# EAGLE schematic fpga (EAGLE 6.6.0)
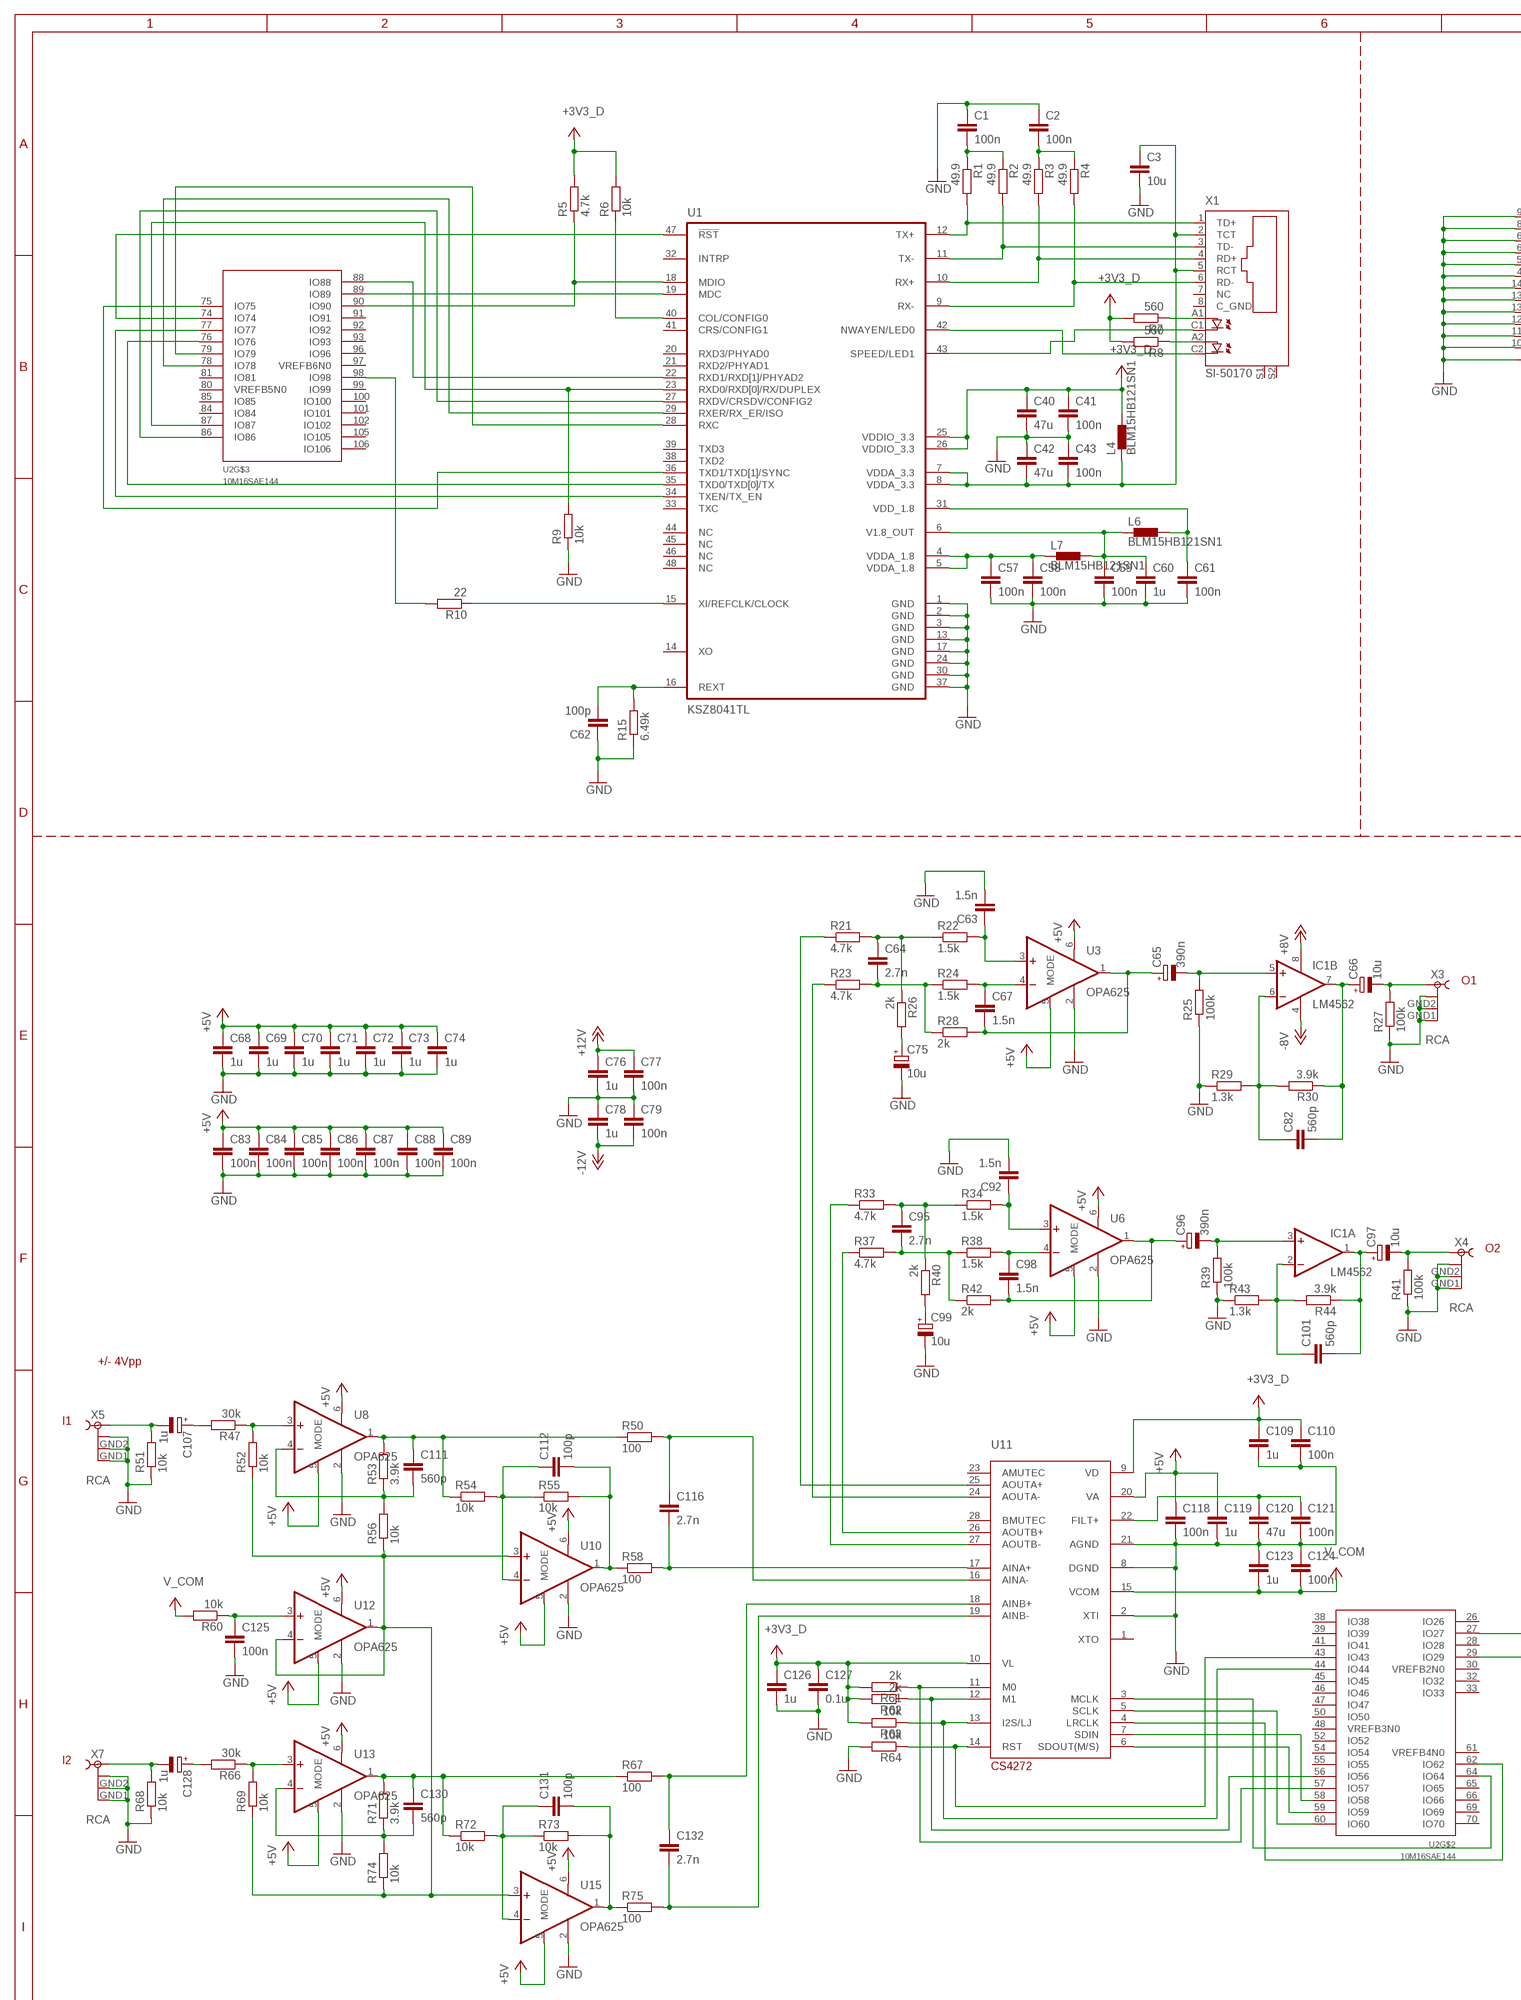
[diagram p0: schematic, sheet 1, part 1 of 2]
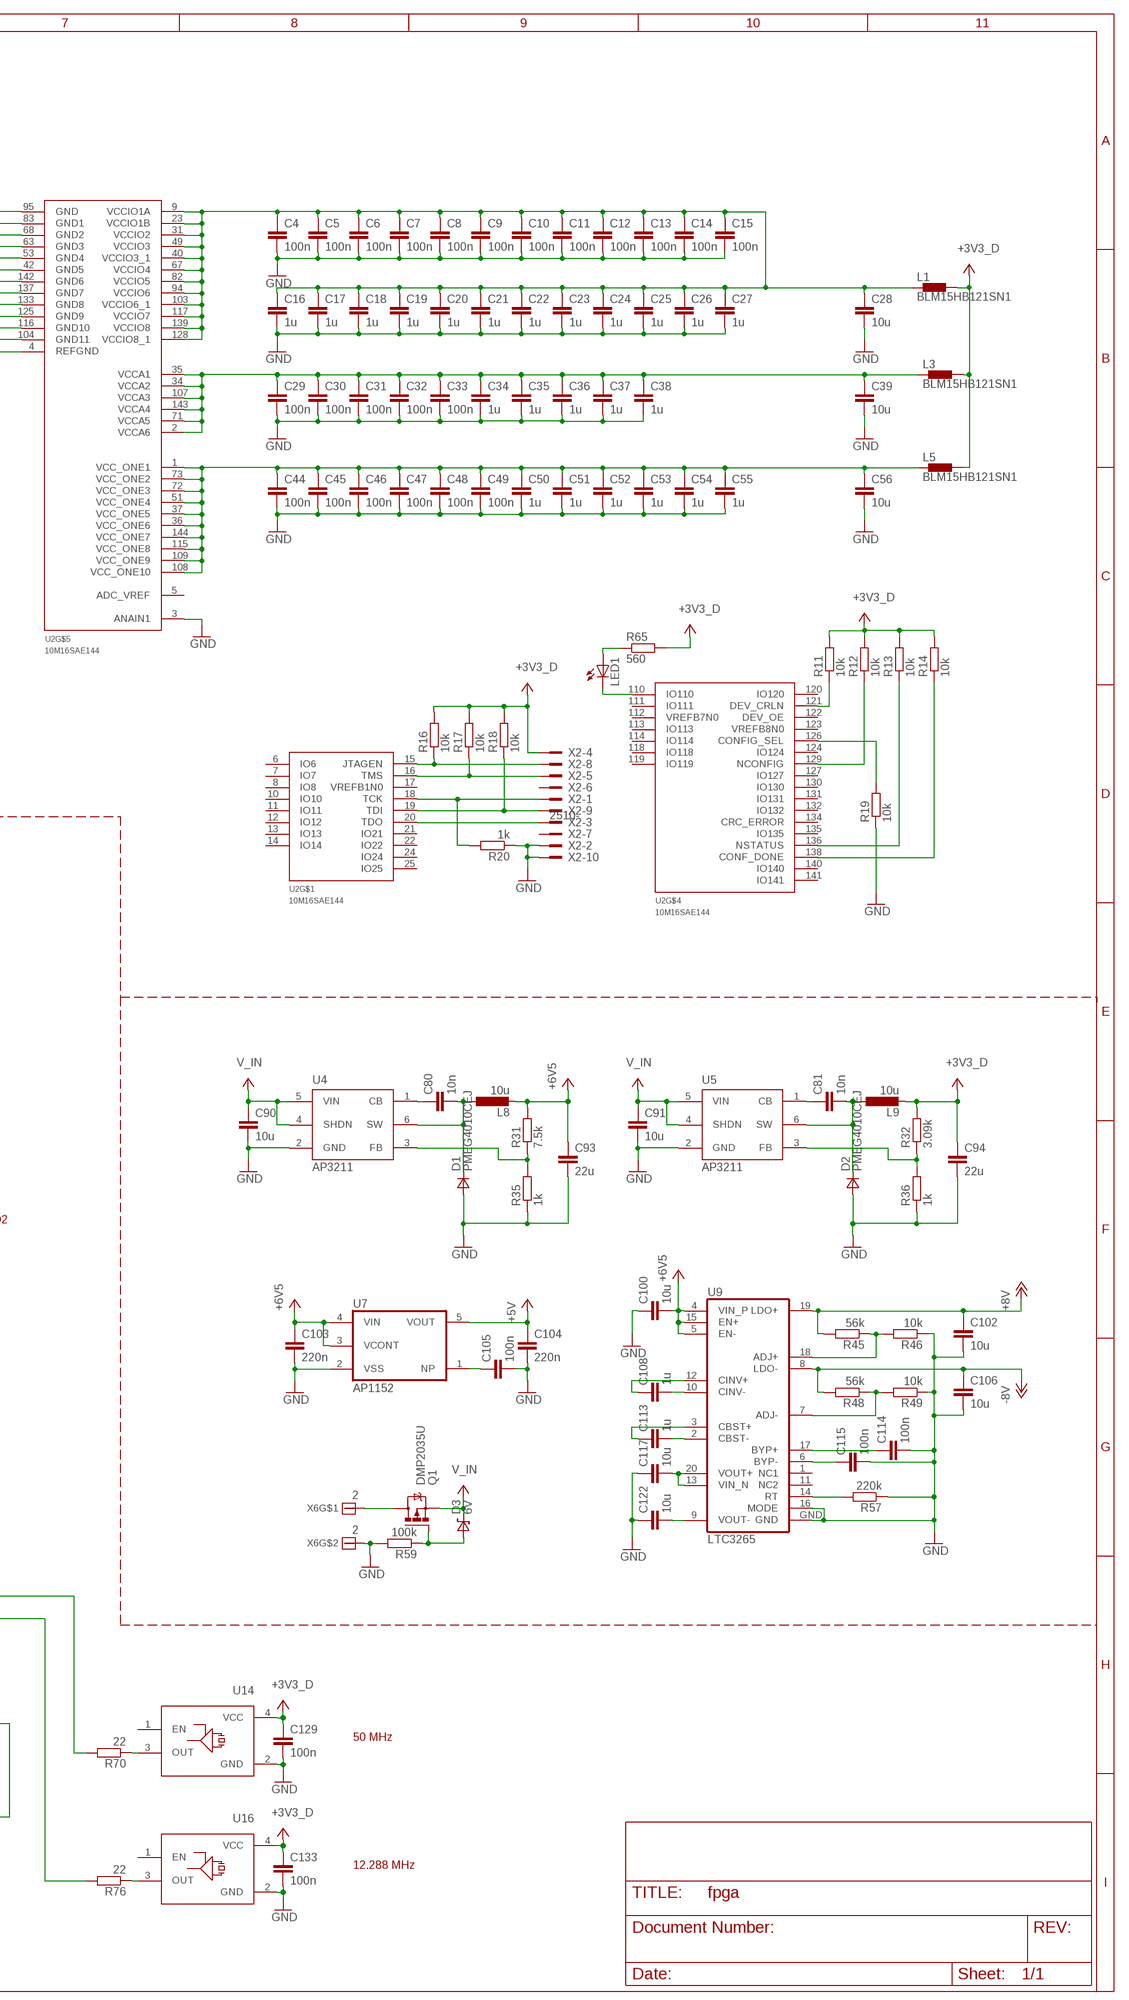
[diagram p1: schematic, sheet 1, part 2 of 2]

## Parts
C1  100n  C-EUC0603K  [C0603K]
C2  100n  C-EUC0603K  [C0603K]
C3  10u  C-EUC0805  [C0805]
C4  100n  C-EUC0603K  [C0603K]
C5  100n  C-EUC0603K  [C0603K]
C6  100n  C-EUC0603K  [C0603K]
C7  100n  C-EUC0603K  [C0603K]
C8  100n  C-EUC0603K  [C0603K]
C9  100n  C-EUC0603K  [C0603K]
C10  100n  C-EUC0603K  [C0603K]
C11  100n  C-EUC0603K  [C0603K]
C12  100n  C-EUC0603K  [C0603K]
C13  100n  C-EUC0603K  [C0603K]
C14  100n  C-EUC0603K  [C0603K]
C15  100n  C-EUC0603K  [C0603K]
C16  1u  C-EUC0603K  [C0603K]
C17  1u  C-EUC0603K  [C0603K]
C18  1u  C-EUC0603K  [C0603K]
C19  1u  C-EUC0603K  [C0603K]
C20  1u  C-EUC0603K  [C0603K]
C21  1u  C-EUC0603K  [C0603K]
C22  1u  C-EUC0603K  [C0603K]
C23  1u  C-EUC0603K  [C0603K]
C24  1u  C-EUC0603K  [C0603K]
C25  1u  C-EUC0603K  [C0603K]
C26  1u  C-EUC0603K  [C0603K]
C27  1u  C-EUC0603K  [C0603K]
C28  10u  C-EUC0603K  [C0603K]
C29  100n  C-EUC0603K  [C0603K]
C30  100n  C-EUC0603K  [C0603K]
C31  100n  C-EUC0603K  [C0603K]
C32  100n  C-EUC0603K  [C0603K]
C33  100n  C-EUC0603K  [C0603K]
C34  1u  C-EUC0603K  [C0603K]
C35  1u  C-EUC0603K  [C0603K]
C36  1u  C-EUC0603K  [C0603K]
C37  1u  C-EUC0603K  [C0603K]
C38  1u  C-EUC0603K  [C0603K]
C39  10u  C-EUC0603K  [C0603K]
C40  47u  C-EUC0805  [C0805]
C41  100n  C-EUC0603K  [C0603K]
C42  47u  C-EUC0805  [C0805]
C43  100n  C-EUC0603K  [C0603K]
C44  100n  C-EUC0603K  [C0603K]
C45  100n  C-EUC0603K  [C0603K]
C46  100n  C-EUC0603K  [C0603K]
C47  100n  C-EUC0603K  [C0603K]
C48  100n  C-EUC0603K  [C0603K]
C49  100n  C-EUC0603K  [C0603K]
C50  1u  C-EUC0603K  [C0603K]
C51  1u  C-EUC0603K  [C0603K]
C52  1u  C-EUC0603K  [C0603K]
C53  1u  C-EUC0603K  [C0603K]
C54  1u  C-EUC0603K  [C0603K]
C55  1u  C-EUC0603K  [C0603K]
C56  10u  C-EUC0603K  [C0603K]
C57  100n  C-EUC0603K  [C0603K]
C58  100n  C-EUC0603K  [C0603K]
C59  100n  C-EUC0603K  [C0603K]
C60  1u  C-EUC0603K  [C0603K]
C61  100n  C-EUC0603K  [C0603K]
C62  100p  C-EUC0603K  [C0603K]
C63  1.5n  C-EUC0603K  [C0603K]
C64  2.7n  C-EUC0603K  [C0603K]
C65  390n  CPOL-EU153CLV-0405  [153CLV-0405]
C66  10u  CPOL-EU153CLV-0405  [153CLV-0405]
C67  1.5n  C-EUC0603K  [C0603K]
C68  1u  C-EUC0603K  [C0603K]
C69  1u  C-EUC0603K  [C0603K]
C70  1u  C-EUC0603K  [C0603K]
C71  1u  C-EUC0603K  [C0603K]
C72  1u  C-EUC0603K  [C0603K]
C73  1u  C-EUC0603K  [C0603K]
C74  1u  C-EUC0603K  [C0603K]
C75  10u  CPOL-EU153CLV-0405  [153CLV-0405]
C76  1u  C-EUC0603K  [C0603K]
C77  100n  C-EUC0603K  [C0603K]
C78  1u  C-EUC0603K  [C0603K]
C79  100n  C-EUC0603K  [C0603K]
C80  10n  C-EUC0603K  [C0603K]
C81  10n  C-EUC0603K  [C0603K]
C82  560p  C-EUC0603K  [C0603K]
C83  100n  C-EUC0603K  [C0603K]
C84  100n  C-EUC0603K  [C0603K]
C85  100n  C-EUC0603K  [C0603K]
C86  100n  C-EUC0603K  [C0603K]
C87  100n  C-EUC0603K  [C0603K]
C88  100n  C-EUC0603K  [C0603K]
C89  100n  C-EUC0603K  [C0603K]
C90  10u  C-EUC0805  [C0805]
C91  10u  C-EUC0805  [C0805]
C92  1.5n  C-EUC0603K  [C0603K]
C93  22u  C-EUC1206  [C1206]
C94  22u  C-EUC1206  [C1206]
C95  2.7n  C-EUC0603K  [C0603K]
C96  390n  CPOL-EU153CLV-0405  [153CLV-0405]
C97  10u  CPOL-EU153CLV-0405  [153CLV-0405]
C98  1.5n  C-EUC0603K  [C0603K]
C99  10u  CPOL-EU153CLV-0405  [153CLV-0405]
C100  10u  C-EUC0603K  [C0603K]
C101  560p  C-EUC0603K  [C0603K]
C102  10u  C-EUC0603K  [C0603K]
C103  220n  C-EUC0603K  [C0603K]
C104  220n  C-EUC0603K  [C0603K]
C105  100n  C-EUC0603K  [C0603K]
C106  10u  C-EUC0603K  [C0603K]
C107  1u  CPOL-EU153CLV-0405  [153CLV-0405]
C108  1u  C-EUC0603K  [C0603K]
C109  1u  C-EUC0603K  [C0603K]
C110  100n  C-EUC0603K  [C0603K]
C111  560p  C-EUC0603K  [C0603K]
C112  100p  C-EUC0603K  [C0603K]
C113  1u  C-EUC0603K  [C0603K]
C114  100n  C-EUC0603K  [C0603K]
C115  100n  C-EUC0603K  [C0603K]
C116  2.7n  C-EUC0603K  [C0603K]
C117  10u  C-EUC0603K  [C0603K]
C118  100n  C-EUC0603K  [C0603K]
C119  1u  C-EUC0603K  [C0603K]
C120  47u  C-EUC0805  [C0805]
C121  100n  C-EUC0603K  [C0603K]
C122  10u  C-EUC0603K  [C0603K]
C123  1u  C-EUC0603K  [C0603K]
C124  100n  C-EUC0603K  [C0603K]
C125  100n  C-EUC0603K  [C0603K]
C126  1u  C-EUC0603K  [C0603K]
C127  0.1u  C-EUC0603K  [C0603K]
C128  1u  CPOL-EU153CLV-0405  [153CLV-0405]
C129  100n  C-EUC0603K  [C0603K]
C130  560p  C-EUC0603K  [C0603K]
C131  100p  C-EUC0603K  [C0603K]
C132  2.7n  C-EUC0603K  [C0603K]
C133  100n  C-EUC0603K  [C0603K]
D1  PMEG4010CEJ  DSOD323  [SOD323]
D2  PMEG4010CEJ  DSOD323  [SOD323]
D3  6V  DSOD323  [SOD323]
IC1  LM4562  LM4558D  [SO08]
L1  BLM15HB121SN1  [0402]
L3  BLM15HB121SN1  [0402]
L4  BLM15HB121SN1  [0402]
L5  BLM15HB121SN1  [0402]
L6  BLM15HB121SN1  [0402]
L7  BLM15HB121SN1  [0402]
L8  10u  L-EU  [AAA]
L9  10u  L-EU  [AAA]
LED1  LEDCHIPLED_0603  [CHIPLED_0603]
Q1  DMP2035U  IRLML5203  [MICRO3]
R1  49.9  R-EU_R0603  [R0603]
R2  49.9  R-EU_R0603  [R0603]
R3  49.9  R-EU_R0603  [R0603]
R4  49.9  R-EU_R0603  [R0603]
R5  4.7k  R-EU_R0603  [R0603]
R6  10k  R-EU_R0603  [R0603]
R7  560  R-EU_R0603  [R0603]
R8  560  R-EU_R0603  [R0603]
R9  10k  R-EU_R0603  [R0603]
R10  22  R-EU_R0603  [R0603]
R11  10k  R-EU_R0603  [R0603]
R12  10k  R-EU_R0603  [R0603]
R13  10k  R-EU_R0603  [R0603]
R14  10k  R-EU_R0603  [R0603]
R15  6.49k  R-EU_R0603  [R0603]
R16  10k  R-EU_R0603  [R0603]
R17  10k  R-EU_R0603  [R0603]
R18  10k  R-EU_R0603  [R0603]
R19  10k  R-EU_R0603  [R0603]
R20  1k  R-EU_R0603  [R0603]
R21  4.7k  R-EU_R0603  [R0603]
R22  1.5k  R-EU_R0603  [R0603]
R23  4.7k  R-EU_R0603  [R0603]
R24  1.5k  R-EU_R0603  [R0603]
R25  100k  R-EU_R0603  [R0603]
R26  2k  R-EU_R0603  [R0603]
R27  100k  R-EU_R0603  [R0603]
R28  2k  R-EU_R0603  [R0603]
R29  1.3k  R-EU_R0603  [R0603]
R30  3.9k  R-EU_R0603  [R0603]
R31  7.5k  R-EU_R0603  [R0603]
R32  3.09k  R-EU_R0603  [R0603]
R33  4.7k  R-EU_R0603  [R0603]
R34  1.5k  R-EU_R0603  [R0603]
R35  1k  R-EU_R0603  [R0603]
R36  1k  R-EU_R0603  [R0603]
R37  4.7k  R-EU_R0603  [R0603]
R38  1.5k  R-EU_R0603  [R0603]
R39  100k  R-EU_R0603  [R0603]
R40  2k  R-EU_R0603  [R0603]
R41  100k  R-EU_R0603  [R0603]
R42  2k  R-EU_R0603  [R0603]
R43  1.3k  R-EU_R0603  [R0603]
R44  3.9k  R-EU_R0603  [R0603]
R45  56k  R-EU_R0603  [R0603]
R46  10k  R-EU_R0603  [R0603]
R47  30k  R-EU_R0603  [R0603]
R48  56k  R-EU_R0603  [R0603]
R49  10k  R-EU_R0603  [R0603]
R50  100  R-EU_R0603  [R0603]
R51  10k  R-EU_R0603  [R0603]
R52  10k  R-EU_R0603  [R0603]
R53  3.9k  R-EU_R0603  [R0603]
R54  10k  R-EU_R0603  [R0603]
R55  10k  R-EU_R0603  [R0603]
R56  10k  R-EU_R0603  [R0603]
R57  220k  R-EU_R0603  [R0603]
R58  100  R-EU_R0603  [R0603]
R59  100k  R-EU_R0603  [R0603]
R60  10k  R-EU_R0603  [R0603]
R61  2k  R-EU_R0603  [R0603]
R62  2k  R-EU_R0603  [R0603]
R63  10k  R-EU_R0603  [R0603]
R64  10k  R-EU_R0603  [R0603]
R65  560  R-EU_R0603  [R0603]
R66  30k  R-EU_R0603  [R0603]
R67  100  R-EU_R0603  [R0603]
R68  10k  R-EU_R0603  [R0603]
R69  10k  R-EU_R0603  [R0603]
R70  22  R-EU_R0603  [R0603]
R71  3.9k  R-EU_R0603  [R0603]
R72  10k  R-EU_R0603  [R0603]
R73  10k  R-EU_R0603  [R0603]
R74  10k  R-EU_R0603  [R0603]
R75  100  R-EU_R0603  [R0603]
R76  22  R-EU_R0603  [R0603]
U1  KSZ8041TL  [TQFP48]
U2  10M16SAE144  [EQFP144]
U3  OPA625  [SOT23-6]
U4  AP3211  LMR14205  [TSOT23-6_DDC]
U5  AP3211  LMR14205  [TSOT23-6_DDC]
U6  OPA625  [SOT23-6]
U7  AP1152  [SOT89-5]
U8  OPA625  [SOT23-6]
U9  LTC3265  [TSSOP20_GND]
U10  OPA625  [SOT23-6]
U11  CS4272  [TSSOP28]
U12  OPA625  [SOT23-6]
U13  OPA625  [SOT23-6]
U14  49.152MHz  LFSPXO009686  [OSC]
U15  OPA625  [SOT23-6]
U16  50MHz  LFSPXO009686  [OSC]
X1  SI-50170  [SI-50170]
X2  2510-  [PAK100/2500-10]
X3  RCA  [RCA]
X4  RCA  [RCA]
X5  RCA  [RCA]
X6  2  [2]
X7  RCA  [RCA]

## Nets
+3V3_D: C40.1 C41.1 C94.1 C109.1 C110.1 C126.1 C127.1 C129.1 C133.1 L1.2 L3.2 L4.2 L5.2 L9.P$2 R5.2 R6.2 R7.2 R8.2 R11.2 R12.2 R13.2 R14.2 R16.2 R17.2 R18.2 R32.2 R61.2 R62.2 R63.2 R65.2 U1.25(VDDIO_3.3) U1.26(VDDIO_3.3) U11.9(VD) U11.10(VL) U14.4(VCC) U16.4(VCC) X2.4
+5V: C68.1 C69.1 C70.1 C71.1 C72.1 C73.1 C74.1 C83.1 C84.1 C85.1 C86.1 C87.1 C88.1 C89.1 C104.1 C118.1 C119.1 U3.5(MODE) U3.6(V+) U6.5(MODE) U6.6(V+) U7.5(VOUT) U8.5(MODE) U8.6(V+) U10.5(MODE) U10.6(V+) U11.20(VA) U12.5(MODE) U12.6(V+) U13.5(MODE) U13.6(V+) U15.5(MODE) U15.6(V+)
+12V: C76.1 C77.1 C102.1 IC1.8(P:V+) R45.2 U9.19(LDO+) ; supply symbol labelled +8V
-12V: C78.2 C79.2 C106.1 IC1.4(P:V-) R48.2 U9.8(LDO-) ; supply symbol labelled -8V
GND: C1.1 C2.1 C3.2 C4.2 C5.2 C6.2 C7.2 C8.2 C9.2 C10.2 C11.2 C12.2 C13.2 C14.2 C15.2 C16.2 C17.2 C18.2 C19.2 C20.2 C21.2 C22.2 C23.2 C24.2 C25.2 C26.2 C27.2 C28.2 C29.2 C30.2 C31.2 C32.2 C33.2 C34.2 C35.2 C36.2 C37.2 C38.2 C39.2 C40.2 C41.2 C42.1 C43.1 C44.2 C45.2 C46.2 C47.2 C48.2 C49.2 C50.2 C51.2 C52.2 C53.2 C54.2 C55.2 C56.2 C57.2 C58.2 C59.2 C60.2 C61.2 C62.1 C63.2 C68.2 C69.2 C70.2 C71.2 C72.2 C73.2 C74.2 C75.- C76.2 C77.2 C78.1 C79.1 C83.2 C84.2 C85.2 C86.2 C87.2 C88.2 C89.2 C90.2 C91.2 C92.2 C93.2 C94.2 C99.- C100.1 C102.2 C103.2 C104.2 C105.2 C106.2 C109.2 C110.2 C114.2 C115.2 C117.1 C118.2 C119.2 C120.2 C121.2 C122.1 C123.1 C124.1 C125.2 C126.2 C127.2 C129.2 C133.2 D1.2(A) D2.2(A) R9.1 R15.1 R19.1 R20.1 R25.1 R27.1 R29.1 R35.1 R36.1 R39.1 R41.1 R43.1 R46.1 R49.1 R51.1 R57.1 R59.2 R64.2 R68.1 U1.1(GND) U1.2(GND) U1.3(GND) U1.13(GND) U1.17(GND) U1.24(GND) U1.30(GND) U1.37(GND) U2.3(ANAIN1) U2.4(REFGND) U2.42(GND5) U2.53(GND4) U2.63(GND3) U2.68(GND2) U2.83(GND1) U2.95(GND) U2.104(GND11) U2.116(GND10) U2.125(GND9) U2.133(GND8) U2.137(GND7) U2.142(GND6) U3.2(V-) U4.2(GND) U5.2(GND) U6.2(V-) U7.2(VSS) U8.2(V-) U9.16(MODE) U9.GND U10.2(V-) U11.2(XTI) U11.8(DGND) U11.21(AGND) U12.2(V-) U13.2(V-) U14.2(GND) U15.2(V-) U16.2(GND) X2.2 X2.10 X3.GND1 X3.GND2 X3.GND3 X4.GND1 X4.GND2 X4.GND3 X5.GND1 X5.GND2 X5.GND3 X6.P$2 X7.GND1 X7.GND2 X7.GND3
N$1: C115.1 U9.6(BYP-)
N$2: R66.1 R69.2 U13.3(+IN)
N$3: C131.2 R73.2 R75.1 U15.1(OUT)
N$4: C120.1 C121.1 U11.22(FILT+)
N$5: C131.1 R72.2 R73.1 U15.4(-IN)
N$6: C125.1 R60.1 U12.3(+IN)
N$7: C95.1 R33.2 R34.1 R40.1
N$8: C132.1 R67.2 U11.18(AINB+)
N$9: C132.2 R75.2 U11.19(AINB-)
N$10: C111.1 R50.1 R53.2 R54.1 U8.1(OUT)
N$11: C44.1 C45.1 C46.1 C47.1 C48.1 C49.1 C50.1 C51.1 C52.1 C53.1 C54.1 C55.1 C56.1 L5.1 U2.1(VCC_ONE1) U2.36(VCC_ONE6) U2.37(VCC_ONE5) U2.51(VCC_ONE4) U2.72(VCC_ONE3) U2.73(VCC_ONE2) U2.108(VCC_ONE10) U2.109(VCC_ONE9) U2.115(VCC_ONE8) U2.144(VCC_ONE7)
N$12: C95.2 R37.2 R38.1 R42.1
N$13: C107.- R51.2 X5.S1
N$14: C128.- R68.2 X7.S1
N$15: C92.1 R34.2 U6.3(+IN)
N$16: C98.1 R38.2 U6.4(-IN)
N$17: C96.+ C98.2 R42.2 U6.1(OUT)
N$18: C97.- R41.2 X4.S1
N$19: C99.+ R40.2
N$20: C75.+ R26.2
N$21: R14.1 U2.138(CONF_DONE)
N$22: R70.1 U14.3(OUT)
N$23: R13.1 U2.136(NSTATUS)
N$24: R37.1 U11.26(AOUTB+)
N$25: R33.1 U11.27(AOUTB-)
N$26: R12.1 U2.129(NCONFIG)
N$27: R23.1 U11.24(AOUTA-)
N$28: R21.1 U11.25(AOUTA+)
N$29: C64.1 R21.2 R22.1 R26.1
N$30: C111.2 R53.1 R56.2 U8.4(-IN)
N$31: R16.1 U2.15(JTAGEN) X2.8
N$32: C64.2 R23.2 R24.1 R28.1
N$33: C63.1 R22.2 U3.3(+IN)
N$34: C67.1 R24.2 U3.4(-IN)
N$35: C65.+ C67.2 R28.2 U3.1(OUT)
N$36: R61.1 U2.57(IO57) U11.11(M0)
N$37: C116.2 R58.2 U11.17(AINA+)
N$38: C130.1 R67.1 R71.2 R72.1 U13.1(OUT)
N$39: C65.- IC1.5(B:+IN) R25.2
N$40: R62.1 U2.56(IO56) U11.12(M1)
N$41: R47.1 R52.2 U8.3(+IN)
N$42: C130.2 R71.1 R74.2 U13.4(-IN)
N$43: C116.1 R50.2 U11.16(AINA-)
N$44: R52.1 R56.1 R69.1 R74.1 U10.3(+IN) U12.1(OUT) U12.4(-IN) U15.3(+IN)
N$45: C80.1 U4.1(CB)
N$46: C112.2 R55.2 R58.1 U10.1(OUT)
N$47: C80.2 D1.1(C) L8.P$1 U4.6(SW)
N$48: C112.1 R54.2 R55.1 U10.4(-IN)
N$49: C81.1 U5.1(CB)
N$50: R31.1 R35.2 U4.3(FB)
N$51: R64.1 U2.43(IO43) U11.14(RST)
N$52: R63.1 U2.44(IO44) U11.13(I2S/LJ)
N$53: U2.64(IO64) U11.3(MCLK)
N$54: U2.60(IO60) U11.5(SCLK)
N$55: U2.62(IO62) U11.4(LRCLK)
N$56: R76.1 U16.3(OUT)
N$57: U2.58(IO58) U11.7(SDIN)
N$58: U2.59(IO59) U11.6(SDOUT(M/S))
N$59: U1.42(NWAYEN/LED0) X1.C2(C1)
N$60: C81.2 D2.1(C) L9.P$1 U5.6(SW)
N$61: R70.2 U2.27(IO27)
N$62: R32.1 R36.2 U5.3(FB)
N$63: R20.2 U2.18(TCK) X2.1
N$64: R19.2 U2.126(CONFIG_SEL)
N$65: C29.1 C30.1 C31.1 C32.1 C33.1 C34.1 C35.1 C36.1 C37.1 C38.1 C39.1 L3.1 U2.2(VCCA6) U2.34(VCCA2) U2.35(VCCA1) U2.71(VCCA5) U2.107(VCCA3) U2.143(VCCA4)
N$66: R17.1 U2.16(TMS) X2.5
N$67: R18.1 U2.19(TDI) X2.9
N$68: C4.1 C5.1 C6.1 C7.1 C8.1 C9.1 C10.1 C11.1 C12.1 C13.1 C14.1 C15.1 C16.1 C17.1 C18.1 C19.1 C20.1 C21.1 C22.1 C23.1 C24.1 C25.1 C26.1 C27.1 C28.1 L1.1 U2.9(VCCIO1A) U2.23(VCCIO1B) U2.31(VCCIO2) U2.40(VCCIO3_1) U2.49(VCCIO3) U2.67(VCCIO4) U2.82(VCCIO5) U2.94(VCCIO6) U2.103(VCCIO6_1) U2.117(VCCIO7) U2.128(VCCIO8_1) U2.139(VCCIO8)
N$69: U2.20(TDO) X2.3
N$70: Q1.3(D) X6.P$1
N$71: U1.43(SPEED/LED1) X1.C1(C)
N$72: C57.1 C58.1 L7.1 U1.4(VDDA_1.8) U1.5(VDDA_1.8)
N$73: LED1.C U2.110(IO110)
N$74: C59.1 C60.1 L6.1 L7.2 U1.6(V1.8_OUT)
N$75: R7.1 X1.A1(A)
N$76: C61.1 L6.2 U1.31(VDD_1.8)
N$77: R8.1 X1.A2(A1)
N$78: R2.2 U1.11(TX-) X1.3(TD-)
N$79: R1.2 U1.12(TX+) X1.1(TD+)
N$80: R3.2 U1.10(RX+) X1.4(RD+)
N$81: R4.2 U1.9(RX-) X1.6(RD-)
N$82: C1.2 R1.1 R2.1
N$83: C2.2 R3.1 R4.1
N$84: LED1.A R65.1
N$85: C3.1 C42.2 C43.2 L4.1 U1.7(VDDA_3.3) U1.8(VDDA_3.3) X1.2(TCT) X1.5(RCT)
N$86: D3.2(A) Q1.1(G) R59.1
N$87: R10.1 U1.15(XI/REFCLK/CLOCK)
N$88: U1.34(TXEN/TX_EN) U2.77(IO77)
N$89: U1.35(TXD0/TXD[0]/TX) U2.76(IO76)
N$90: U1.36(TXD1/TXD[1]/SYNC) U2.75(IO75)
N$91: U1.22(RXD1/RXD[1]/PHYAD2) U2.88(IO88)
N$92: R9.2 U1.23(RXD0/RXD[0]/RX/DUPLEX) U2.87(IO87)
N$93: U1.27(RXDV/CRSDV/CONFIG2) U2.86(IO86)
N$94: U1.29(RXER/RX_ER/ISO) U2.78(IO78)
N$95: R10.2 U2.98(IO98)
N$96: R6.1 U1.40(COL/CONFIG0)
N$97: U1.19(MDC) U2.89(IO89)
N$98: R5.1 U1.18(MDIO) U2.90(IO90)
N$99: U1.28(RXC) U2.79(IO79)
N$100: U1.47(!RST) U2.74(IO74)
N$101: C62.2 R15.2 U1.16(REXT)
N$102: R76.2 U2.29(IO29)
N$103: C96.- IC1.3(A:+IN) R39.2
N$104: C82.1 IC1.6(B:-IN) R29.2 R30.2
N$105: C66.+ C82.2 IC1.7(B:OUT) R30.1
N$106: C66.- R27.2 X3.S1
N$108: C101.1 IC1.2(A:-IN) R43.2 R44.2
N$109: C97.+ C101.2 IC1.1(A:OUT) R44.1
N$111: R45.1 R46.2 U9.18(ADJ+)
N$112: C113.2 U9.2(CBST-)
N$113: C113.1 U9.3(CBST+)
N$114: C108.2 U9.10(CINV-)
N$115: C108.1 U9.12(CINV+)
N$116: C105.1 U7.1(NP)
N$117: C122.2 U9.9(VOUT-)
N$118: C117.2 U9.13(VIN_N) U9.20(VOUT+)
N$119: R57.2 U9.14(RT)
N$120: C107.+ R47.2
N$121: C114.1 U9.17(BYP+)
N$122: R48.1 R49.2 U9.7(ADJ-)
N$123: C128.+ R66.2
N$124: R11.1 U2.121(DEV_CRLN)
V_COM: C123.2 C124.2 R60.2 U11.15(VCOM)
V_IN: C90.1 C91.1 D3.1(C) Q1.2(S) U4.4(SHDN) U4.5(VIN) U5.4(SHDN) U5.5(VIN)
VCC: C93.1 C100.2 C103.1 L8.P$2 R31.2 U7.3(VCONT) U7.4(VIN) U9.4(VIN_P) U9.5(EN-) U9.15(EN+) ; supply symbol labelled +6V5
Unconnected: U1.14(XO) U1.20(RXD3/PHYAD0) U1.21(RXD2/PHYAD1) U1.32(INTRP) U1.33(TXC) U1.38(TXD2) U1.39(TXD3) U1.41(CRS/CONFIG1) U1.44(NC) U1.45(NC) U1.46(NC) U1.48(NC) U2.5(ADC_VREF) U2.6(IO6) U2.7(IO7) U2.8(IO8) U2.10(IO10) U2.11(IO11) U2.12(IO12) U2.13(IO13) U2.14(IO14) U2.17(VREFB1N0) U2.21(IO21) U2.22(IO22) U2.24(IO24) U2.25(IO25) U2.26(IO26) U2.28(IO28) U2.30(VREFB2N0) U2.32(IO32) U2.33(IO33) U2.38(IO38) U2.39(IO39) U2.41(IO41) U2.45(IO45) U2.46(IO46) U2.47(IO47) U2.48(VREFB3N0) U2.50(IO50) U2.52(IO52) U2.54(IO54) U2.55(IO55) U2.61(VREFB4N0) U2.65(IO65) U2.66(IO66) U2.69(IO69) U2.70(IO70) U2.80(VREFB5N0) U2.81(IO81) U2.84(IO84) U2.85(IO85) U2.91(IO91) U2.92(IO92) U2.93(IO93) U2.96(IO96) U2.97(VREFB6N0) U2.99(IO99) U2.100(IO100) U2.101(IO101) U2.102(IO102) U2.105(IO105) U2.106(IO106) U2.111(IO111) U2.112(VREFB7N0) U2.113(IO113) U2.114(IO114) U2.118(IO118) U2.119(IO119) U2.120(IO120) U2.122(DEV_OE) U2.123(VREFB8N0) U2.124(IO124) U2.127(IO127) U2.130(IO130) U2.131(IO131) U2.132(IO132) U2.134(CRC_ERROR) U2.135(IO135) U2.140(IO140) U2.141(IO141) U9.1(NC1) U9.11(NC2) U11.1(XTO) U11.23(AMUTEC) U11.28(BMUTEC) U14.1(EN) U16.1(EN) X1.7(NC) X1.8(C_GND) X1.S1 X1.S2 X2.6 X2.7

## Notes on the sheet
- O1
- O2
- +/- 4Vpp
- I1
- I2
- 50 MHz
- 12.288 MHz

## Library data of the parts
C1-C64 C67-C74 C76-C95 C98 C100-C106 C108-C127 C129-C133 = rcl:C-EU: CAPACITOR, European symbol
C65 C66 C75 C96 C97 C99 C107 C128 = rcl:CPOL-EU: POLARIZED CAPACITOR, European symbol
D1-D3 = zetex:D: DIODE; MPN: CDSOD323-T05C; OC_FARNELL: 1824860; OC_NEWARK: 79R6078
IC1 = linear2:*4558: OP AMP
L1 L3-L7 = inductors:BLM15H: EMIFIL (R) Chip Ferrite Bead for GHz Noise Source: http://www.murata.com/ Ferrite Bead BLM15H.pdf
L8 L9 = rcl_COPY:L-EU: INDUCTOR, European symbol
LED1 = led:LED: LED OSRAM: - CHIPLED LG R971, LG N971, LY N971, LG Q971, LY Q971, LO R971, LY R971 LH N974, LH R974 LS Q976, LO Q976, LY Q976 LO Q996 - Hyper CHIPLED LW Q18S LB Q993, LB Q99A, LB R99A - SideLED LS A670, LO A670, LY A670, LG A670, LP A670 LB A673, LV A673, LT A673, LW A673 LH A674 LY A675 LS A676, LA A676, LO A676, LY A676, LW A676 LS A679, LY A679, LG A679 - Hyper Micro SIDELED® LS Y876, LA Y876, LO Y876, LY Y876 LT Y87S - SmartLED LW L88C, LW L88S LB L89C, LB L89S, LG L890 LS L89K, LO L89K, LY L89K LS L896, LA L896, LO L896, LY L896 - TOPLED LS T670, LO T670, LY T670, LG T670, LP T670 LSG T670, LSP T670, LSY T670, LOP T670, LYG T670 LG T671, LOG T671, LSG T671 LB T673, LV T673, LT T673, LW T673 LH T674 LS T676, LA T676, LO T676, LY T676, LB T676, LH T676, LSB T676, LW T676 LB T67C, LV T67C, LT T67C, LS T67K, LO T67K, LY T67K, LW E67C LS E67B, LA E67B, LO E67B, LY E67B, LB E67C, LV E67C, LT E67C LW T67C LS T679, LY T679, LG T679 LS T770, LO T770, LY T770, LG T770, LP T770 LB T773, LV T773, LT T773, LW T773 LH T774 LS E675, LA E675, LY E675, LS T675 LS T776, LA T776, LO T776, LY T776, LB T776 LHGB T686 LT T68C, LB T68C - Hyper Mini TOPLED® LB M676 - Mini TOPLED Santana® LG M470 LS M47K, LO M47K, LY M47K Source: http://www.osram.convergy.de LUXEON: - LUMILED® LXK2-PW12-R00, LXK2-PW12-S00, LXK2-PW14-U00, LXK2-PW14-V00 LXK2-PM12-R00, LXK2-PM12-S00, LXK2-PM14-U00 LXK2-PE12-Q00, LXK2-PE12-R00, LXK2-PE12-S00, LXK2-PE14-T00, LXK2-PE14-U00 LXK2-PB12-K00, LXK2-PB12-L00, LXK2-PB12-M00, LXK2-PB14-N00, LXK2-PB14-P00, LXK2-PB14-Q00 LXK2-PR12-L00, LXK2-PR12-M00, LXK2-PR14-Q00, LXK2-PR14-R00 LXK2-PD12-Q00, LXK2-PD12-R00, LXK2-PD12-S00 LXK2-PH12-R00, LXK2-PH12-S00 LXK2-PL12-P00, LXK2-PL12-Q00, LXK2-PL12-R00 Source: www.luxeon.com KINGBRIGHT: KA-3528ASYC Source: www.kingbright.com
Q1 = transistor-power:IRLML5203: HEXFET P-Channel Power MOSFET
R1-R76 = resistor:R-EU_: RESISTOR, European symbol
U1 = micrel_phy:KSZ8041TL: Physical Layer Transceiver 10Base-T/100Base-TX/100Base-FX
U2 = altera-cyclone-III_2:10M16SAE144
U3 U6 U8 U10 U12 U13 U15 = linear2:OPA625
U4 U5 = texas_copy:LMR14205
U7 = torex:AP1152
U9 = maxim2:LTC3265
U11 = analog-devices:CS4272
U14 U16 = switch-misc2:LFSPXO009686
X1 = con-stewart:SI-50170: Ethernet Connector MagJack (R) Source: www.stewartconnector.com .. si-50170.pdf; OC_FARNELL: unknown; OC_NEWARK: unknown
X2 = con-3m2:2510-: 3M (TM) Pak 100 4-Wall Header Source: 3M; MF: 3M; MPN: 2510-6002UB; OC_FARNELL: 9838244; OC_NEWARK: 46F4725
X3-X5 X7 = con-hirschmann_copy:RCA
X6 = con-phoenix-3.81_copy:2